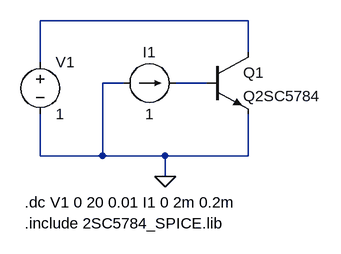
[diagram p0: schematic Fig_10-4_2SC5784_V-I.asc]
Fig_10-4_2SC5784_V-I.asc, the LTspice schematic file:
Version 4
SHEET 1 880 680
WIRE 320 48 0 48
WIRE 320 96 320 48
WIRE 0 112 0 48
WIRE 128 144 96 144
WIRE 256 144 208 144
WIRE 0 256 0 192
WIRE 96 256 96 144
WIRE 96 256 0 256
WIRE 192 256 96 256
WIRE 320 256 320 192
WIRE 320 256 192 256
WIRE 192 288 192 256
FLAG 192 288 0
SYMBOL current 128 144 M90
WINDOW 0 -32 40 VBottom 2
WINDOW 3 32 40 VTop 2
WINDOW 123 0 0 Left 2
WINDOW 39 0 0 Left 2
SYMATTR InstName I1
SYMATTR Value 1
SYMBOL npn 256 96 R0
SYMATTR InstName Q1
SYMATTR Value Q2SC5784
SYMBOL voltage 0 96 R0
WINDOW 123 0 0 Left 2
WINDOW 39 0 0 Left 2
SYMATTR InstName V1
SYMATTR Value 1
TEXT -24 360 Left 2 !.include 2SC5784_SPICE.lib
TEXT -24 328 Left 2 !.dc V1 0 20 0.01 I1 0 2m 0.2m

The netlist it stands for:
* Fig_10-4_2SC5784_V-I.asc
I1 0 N002 1
Q1 N001 N002 0 0 Q2SC5784
V1 N001 0 1
.model NPN NPN
.model PNP PNP
.lib standard.bjt
.include 2SC5784_SPICE.lib
.dc V1 0 20 0.01 I1 0 2m 0.2m
.backanno
.end